# Altium schematic sheet Heater MOSFET Channel.SchDoc
size A
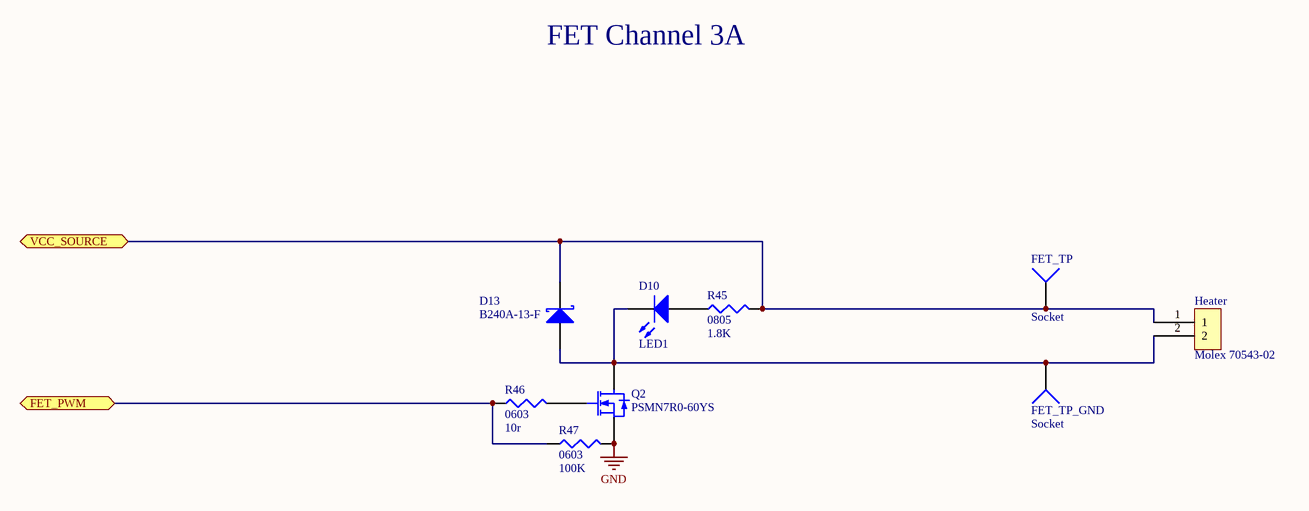
[diagram p0: Heater MOSFET Channel.SchDoc]

## Parts
D10  LED1  [SM 0805 polarized]
D13  B240A-13-F  [SMB]
FET_TP  Socket  [PIN1]
FET_TP_GND  Socket  [PIN1]
Heater  Molex 70543-02  [70543-02]
Q2  PSMN7R0-60YS  [PSMN7R0-60YS]
R45  0805  value 1.8K  [SM 0805 - gap trimmed]
R46  0603  value 10r  [J1-0603]
R47  0603  value 100K  [J1-0603]

## Ports
FET_PWM, VCC_SOURCE

## Nets
2: Q2.4(D)
GND: Q2.3(S) R47.2
FET_PWM: R46.1 R47.1 ; port FET_PWM
VCC_SOURCE: D13.2(K) FET_TP.1 Heater.1 R45.2 ; port VCC_SOURCE
NetD10_1: D10.1(A) R45.1
NetD10_2: D10.2(K) D13.1(A) FET_TP_GND.1 Heater.2 Q2.2(D)
NetQ2_1: Q2.1(G) R46.2

## Notes on the sheet
- FET Channel 3A

## Library data of the parts
D10 = LED1: Typical RED GaAs LED; Published: 8-Jun-2000; LatestRevisionDate: 08-Jul-2005; LatestRevisionNote: Mech Layer 1 removed.; PackageReference: LED-1; Publisher: Altium Limited; PackageDescription: LED; 2 Leads
D13 = D Schottky: Schottky Diode; Published: 8-Jun-2000; LatestRevisionDate: 17-Jul-2002; LatestRevisionNote: Re-released for DXP Platform.; PackageReference: SMB; Publisher: Altium Limited; PackageDescription: DO-214-AA/SMB; 2 C-Bend Leads; Body 5.3 x 3.6 mm, inc. leads (LxW); Code_JEDEC: DO-214-AA
Q2 = Fairchild FDT439N: N-Channel MOSFET; Published: 8-Jun-2000; LatestRevisionDate: 17-Jul-2002; LatestRevisionNote: Re-released for DXP Platform.; PackageVersion: 1995/1996; PackageReference: E3; Publisher: Altium Limited; PackageDescription: TO, Flat Index; 3 In-Line, Axial Leads; Body Dia. 4.6mm; Lead Dia. 0.5 mm (max)
R45-R47 = Res3: Resistor; Published: 8-Jun-2000; LatestRevisionDate: 29-May-2009; LatestRevisionNote: IPC-7351 Footprint Added.; PackageReference: J1-0603; Publisher: Altium Limited; PackageDescription: Chip Resistor
FET_TP FET_TP_GND = Socket: LatestRevisionDate: 17-Jul-2002; LatestRevisionNote: Re-released for DXP Platform.; Publisher: Altium Limited